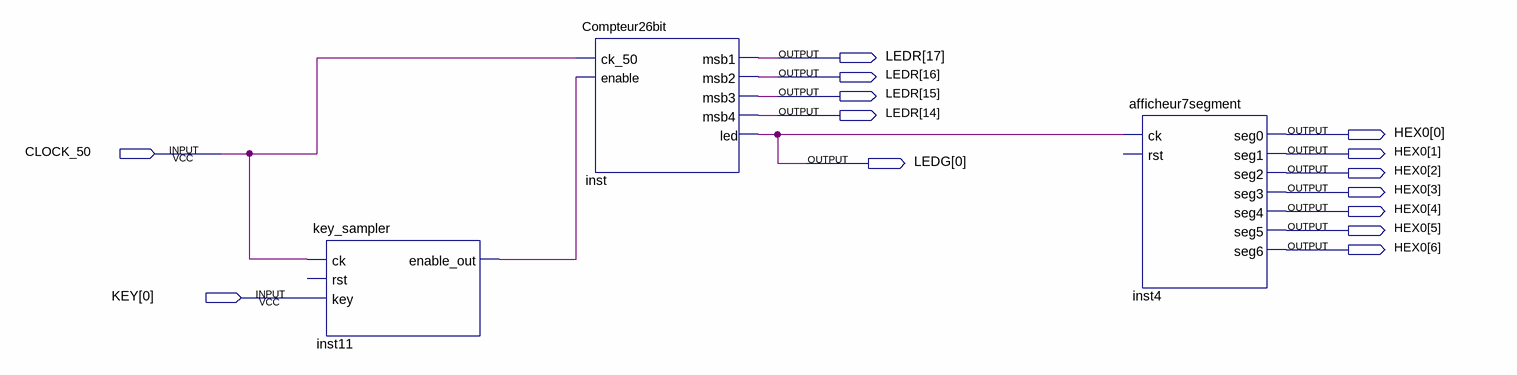
[diagram p0: schematic sheet]
// Quartus schematic TP4_CODEC_audio.bdf as structural Verilog: 3 symbols, 14 pins
module TP4_CODEC_audio (
  input  CLOCK_50,
  input  [0:0] KEY,
  output [17:14] LEDR,
  output [6:0] HEX0,
  output [0:0] LEDG
);

  wire inst11_enable_out;

  key_sampler inst11 (.ck(CLOCK_50), .key(KEY[0]), .enable_out(inst11_enable_out));  // open: rst
  Compteur26bit inst (
    .ck_50(CLOCK_50), .enable(inst11_enable_out), .msb1(LEDR[17]), .msb2(LEDR[16]), .msb3(LEDR[15]),
    .msb4(LEDR[14]), .led(LEDG[0]));
  afficheur7segment inst4 (
    .ck(LEDG[0]), .seg0(HEX0[0]), .seg1(HEX0[1]), .seg2(HEX0[2]), .seg3(HEX0[3]), .seg4(HEX0[4]),
    .seg5(HEX0[5]), .seg6(HEX0[6]));  // open: rst
endmodule
